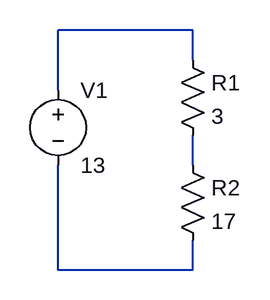
[diagram p0: schematic 2series.asc]
2series.asc, the LTspice schematic file:
Version 4
SHEET 1 880 680
WIRE 240 64 96 64
WIRE 240 96 240 64
WIRE 96 128 96 64
WIRE 240 208 240 176
WIRE 96 320 96 208
WIRE 240 320 240 288
WIRE 240 320 96 320
SYMBOL voltage 96 112 R0
WINDOW 123 0 0 Left 0
WINDOW 39 0 0 Left 0
SYMATTR InstName V1
SYMATTR Value 13
SYMBOL res 224 80 R0
SYMATTR InstName R1
SYMATTR Value 3
SYMBOL res 224 192 R0
SYMATTR InstName R2
SYMATTR Value 17

The netlist it stands for:
* 2series.asc
V1 N001 N003 13
R1 N001 N002 3
R2 N002 N003 17
.backanno
.end